# EAGLE design door (EAGLE 6.5.0)
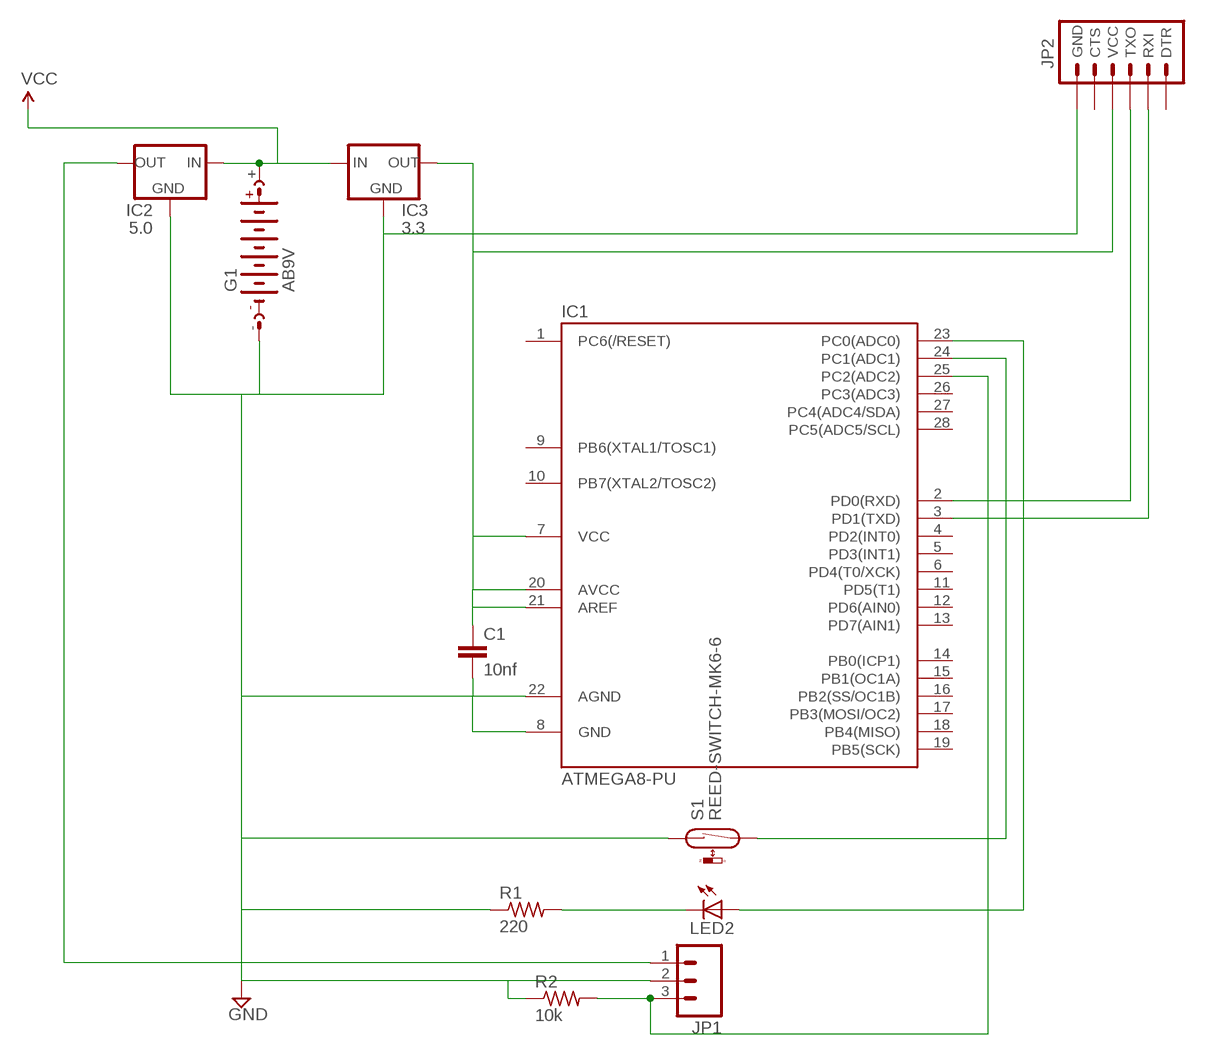
[diagram p0: schematic, sheet 1]

## Parts
C1  10nf  C2.5/4  [C2.5-4]
G1  AB9V  [AB9V]
IC1  ATMEGA8-PU  [DIL28-3]
IC2  5.0  V_REG_78XXSINK  [TO220-IGO]
IC3  3.3  V_REG_78XXSINK  [TO220-IGO]
JP1  M03PTH  [1X03]
JP2  ARDUINO_SERIAL_PROGRAMLONGPADS  [1X06_LONGPADS]
LED2  LED3MM  [LED3MM]
R1  220  R-US_0207/12  [0207/12]
R2  10k  R-US_0207/12  [0207/12]
S1  REED-SWITCH-MK6-6  [MK6-6]

## Nets
GND: C1.2 G1.- IC1.8(GND) IC1.22(AGND) IC2.GND IC3.GND JP1.2(GND) JP2.6(GND) R1.1 R2.1 S1.1
N$1: IC2.OUT JP1.1(OUT)
N$2: IC1.3(PD1(TXD)) JP2.2(RXI)
N$3: IC1.2(PD0(RXD)) JP2.3(TXO)
N$4: IC1.24(PC1(ADC1)) S1.2
N$5: IC1.23(PC0(ADC0)) LED2.A
N$6: IC1.25(PC2(ADC2)) JP1.3(VCC) R2.2
N$7: LED2.K(C) R1.2
N$8: C1.1 IC1.7(VCC) IC1.20(AVCC) IC1.21(AREF) IC3.OUT JP2.4(VCC)
VCC: G1.+ IC2.IN IC3.IN
Unconnected: IC1.1(PC6(/RESET)) IC1.4(PD2(INT0)) IC1.5(PD3(INT1)) IC1.6(PD4(T0/XCK)) IC1.9(PB6(XTAL1/TOSC1)) IC1.10(PB7(XTAL2/TOSC2)) IC1.11(PD5(T1)) IC1.12(PD6(AIN0)) IC1.13(PD7(AIN1)) IC1.14(PB0(ICP1)) IC1.15(PB1(OC1A)) IC1.16(PB2(SS/OC1B)) IC1.17(PB3(MOSI/OC2)) IC1.18(PB4(MISO)) IC1.19(PB5(SCK)) IC1.26(PC3(ADC3)) IC1.27(PC4(ADC4/SDA)) IC1.28(PC5(ADC5/SCL)) JP2.1(DTR) JP2.5(CTS)

## Library data of the parts
C1 = capacitor-wima:C: CAPACITOR naming: grid - package width
G1 = battery:AB9V: 9-V BATTERY CLIP
IC1 = atmega8:ATMEGA8-PU
IC2 IC3 = SparkFun:V_REG_78XX: Voltage Regulator Standard 7805 5V regulator. IGO (Input Ground Output). Spark Fun Electronics SKU : COM-00107
JP1 = SparkFun:M03: Header 3 Standard 3-pin 0.1" header. Use with straight break away headers (SKU : PRT-00116), right angle break away headers (PRT-00553), swiss pins (PRT-00743), machine pins (PRT-00117), and female headers (PRT-00115). Molex polarized connector foot print use with SKU : PRT-08232 with associated crimp pins and housings.
JP2 = SparkFun:ARDUINO_SERIAL_PROGRAM
LED2 = led:LED: LED OSRAM: - CHIPLED LG R971, LG N971, LY N971, LG Q971, LY Q971, LO R971, LY R971 LH N974, LH R974 LS Q976, LO Q976, LY Q976 LO Q996 - Hyper CHIPLED LW Q18S LB Q993, LB Q99A, LB R99A - SideLED LS A670, LO A670, LY A670, LG A670, LP A670 LB A673, LV A673, LT A673, LW A673 LH A674 LY A675 LS A676, LA A676, LO A676, LY A676, LW A676 LS A679, LY A679, LG A679 - Hyper Micro SIDELED® LS Y876, LA Y876, LO Y876, LY Y876 LT Y87S - SmartLED LW L88C, LW L88S LB L89C, LB L89S, LG L890 LS L89K, LO L89K, LY L89K LS L896, LA L896, LO L896, LY L896 - TOPLED LS T670, LO T670, LY T670, LG T670, LP T670 LSG T670, LSP T670, LSY T670, LOP T670, LYG T670 LG T671, LOG T671, LSG T671 LB T673, LV T673, LT T673, LW T673 LH T674 LS T676, LA T676, LO T676, LY T676, LB T676, LH T676, LSB T676, LW T676 LB T67C, LV T67C, LT T67C, LS T67K, LO T67K, LY T67K, LW E67C LS E67B, LA E67B, LO E67B, LY E67B, LB E67C, LV E67C, LT E67C LW T67C LS T679, LY T679, LG T679 LS T770, LO T770, LY T770, LG T770, LP T770 LB T773, LV T773, LT T773, LW T773 LH T774 LS E675, LA E675, LY E675, LS T675 LS T776, LA T776, LO T776, LY T776, LB T776 LHGB T686 LT T68C, LB T68C - Hyper Mini TOPLED® LB M676 - Mini TOPLED Santana® LG M470 LS M47K, LO M47K, LY M47K Source: http://www.osram.convergy.de LUXEON: - LUMILED® LXK2-PW12-R00, LXK2-PW12-S00, LXK2-PW14-U00, LXK2-PW14-V00 LXK2-PM12-R00, LXK2-PM12-S00, LXK2-PM14-U00 LXK2-PE12-Q00, LXK2-PE12-R00, LXK2-PE12-S00, LXK2-PE14-T00, LXK2-PE14-U00 LXK2-PB12-K00, LXK2-PB12-L00, LXK2-PB12-M00, LXK2-PB14-N00, LXK2-PB14-P00, LXK2-PB14-Q00 LXK2-PR12-L00, LXK2-PR12-M00, LXK2-PR14-Q00, LXK2-PR14-R00 LXK2-PD12-Q00, LXK2-PD12-R00, LXK2-PD12-S00 LXK2-PH12-R00, LXK2-PH12-S00 LXK2-PL12-P00, LXK2-PL12-Q00, LXK2-PL12-R00 Source: www.luxeon.com KINGBRIGHT: KA-3528ASYC Source: www.kingbright.com
R1 R2 = resistor:R-US_: RESISTOR, American symbol
S1 = switch-reed:REED-SWITCH-: Reed Sensor; OC_FARNELL: unknown

## Board
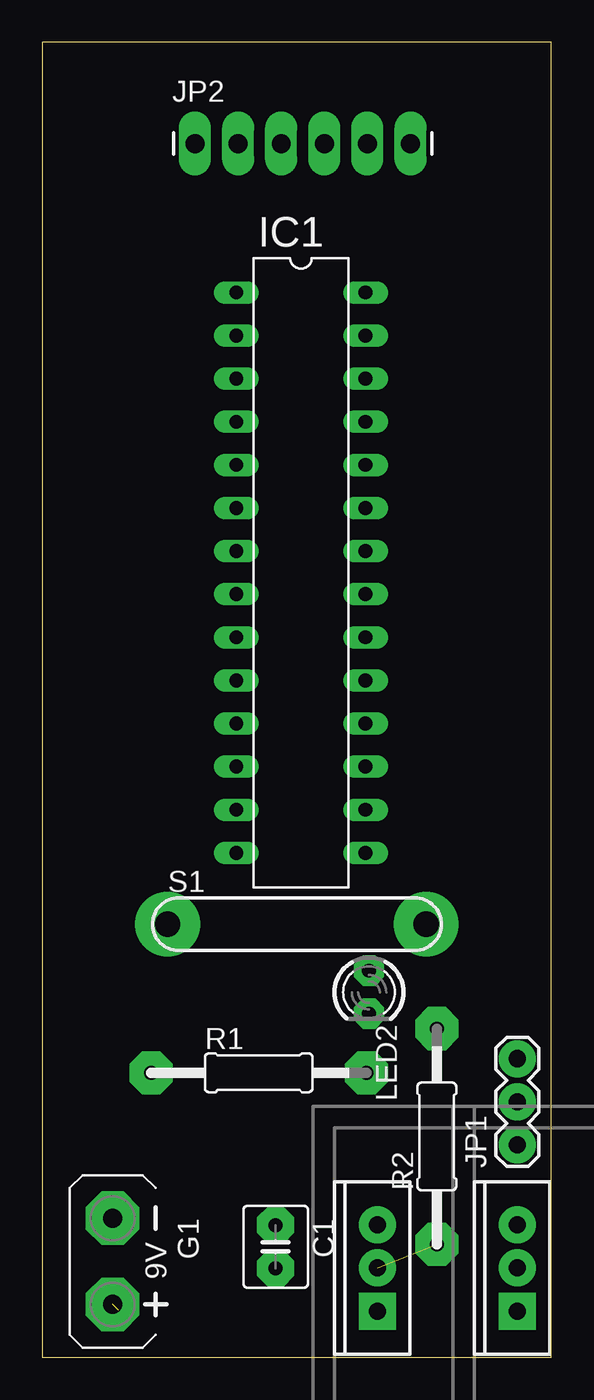
[diagram p1: board, top side]
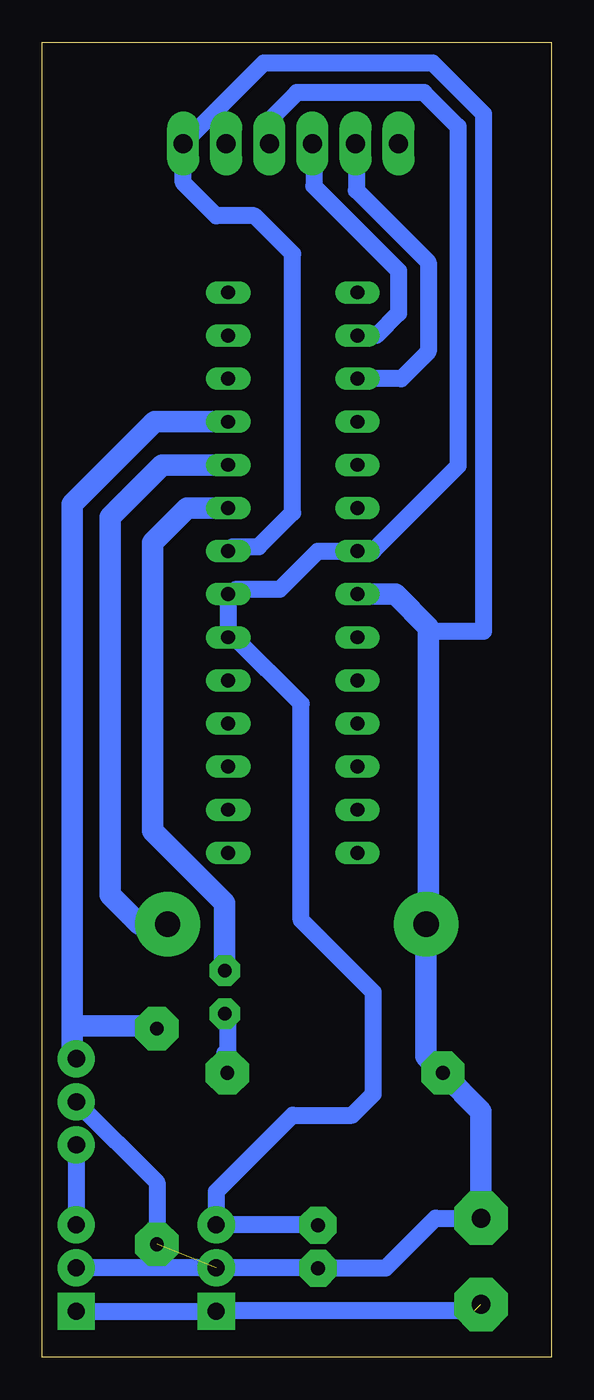
[diagram p2: board, bottom side, seen from below]

Size 30 x 77.46 mm. Coordinates in mm from the lower left corner, seen from the top.
Outline: 0,0 30,0 30,77.46 0,77.46 0,0
Copper layers (1*16): Top 0.035mm / dielectric 1.5mm / Bottom 0.035mm
Design rules "default *": minimum track width 10mil, minimum drill 24mil, track to track 8mil, track to pad 8mil, pad to pad 8mil, via to via 8mil, smd to smd 8mil, copper to edge 40mil, drill to drill 8mil, minimum pad ring 10mil, minimum via ring 8mil, stop-mask expansion 6mil, vias tented up to drill 0mil, thermal gap 10mil

### Footprints (pad centres in the part's own frame; a part is rotated, then mirrored left to right if it is on the bottom)
C2.5-4 = drill 0.813 pad 2.184 octagon: 1 -1.27,0; 2 1.27,0
AB9V = drill 1.118 pad 3.15 octagon: + 0,2.54; - 0,-2.54
DIL28-3 = drill 0.813 long: 1 -16.51,-3.81; 2 -13.97,-3.81; 3 -11.43,-3.81; 4 -8.89,-3.81; 5 -6.35,-3.81; 6 -3.81,-3.81; 7 -1.27,-3.81; 8 1.27,-3.81; 9 3.81,-3.81; 10 6.35,-3.81; 11 8.89,-3.81; 12 11.43,-3.81; 13 13.97,-3.81; 14 16.51,-3.81; 15 16.51,3.81; 16 13.97,3.81; 17 11.43,3.81; 18 8.89,3.81; 19 6.35,3.81; 20 3.81,3.81; 21 1.27,3.81; 22 -1.27,3.81; 23 -3.81,3.81; 24 -6.35,3.81; 25 -8.89,3.81; 26 -11.43,3.81; 27 -13.97,3.81; 28 -16.51,3.81
TO220-IGO = drill 1 pad 2.184: GND 0,0; OUT 2.54,0 | drill 1 pad 2.184 square: IN -2.54,0
1X03 = drill 1.016 pad 2.184: 1 0,0; 2 2.54,0; 3 5.08,0
1X06_LONGPADS = drill 1.118 pad 1.88 long: 1 0,0; 2 2.54,0; 3 5.08,0; 4 7.62,0; 5 10.16,0; 6 12.7,0
LED3MM = drill 0.813 pad 1.778 octagon: A -1.27,0; K 1.27,0
0207/12 = drill 0.813 pad 2.54 octagon: 1 -6.35,0; 2 6.35,0
MK6-6 = drill 1.5 pad 3.81: 1 -7.62,0; 2 7.62,0

### Placement (x,y rotation side)
C1  13.75,6.5 270 top
G1  4.14,5.64 180 top
IC1  15.24,46.22 270 top
IC2  28,5.25 90 top
IC3  19.75,5.25 90 top
JP1  28,12.5 90 top
JP2  9,71.5 0 top
LED2  19.25,21.5 270 top
R1  12.75,16.75 0 top
R2  23.25,13 90 top
S1  15,25.5 0 top

### Tracks (layer width: path | path; a pad name or v marks a point on that pad's centre or on a via)
GND  (1 unrouted)
  Bottom 1.016: 7.25,42.75 4,42.75 4,73.25 7,76.25 16.95,76.25 JP2.6 21.7,69.2 19.75,67.25 17.5,67.25 15.25,65 15.25,49.75 17.25,47.75 18.79,47.75 IC1.22 | JP1.2 23.25,10.29 R2.1 | IC2.GND IC3.GND 13.77,5.25 C1.2 13.73,5.25 9.75,5.25 6.82,8.18 G1.-
  Bottom 1.27: G1.- 4.14,14.49 R1.1 7.38,17.73 S1.1 7.25,25.63 7.25,42.75 7.25,43 9.2,44.95 IC1.8
N$1
  Bottom 1.016: JP1.1 IC2.OUT
N$2
  Bottom 1.016: JP2.2 11.5,71.46 11.5,68.75 7.25,64.5 7.25,59.25 8.85,57.65 IC1.3
N$3
  Bottom 1.016: JP2.3 14,71.42 14,69 9,64 9,61.5 10.31,60.19 IC1.2
N$4
  Bottom 1.27: IC1.24 22.93,52.57 26,49.5 26,27.23 24.27,25.5 S1.2
N$5
  Bottom 1.27: LED2.A 19.25,26.75 23.5,31 23.5,48 21.47,50.03 IC1.23
N$6
  Bottom 1.016: R2.2 23.4,19.5
  Bottom 1.27: 28.25,19.5 28.25,50.25 23.39,55.11 IC1.25 | 23.4,19.5 28.25,19.5 | JP1.3 28.25,17.58 28.25,19.5
N$7
  Bottom 1.016: 19.25,17.9 R1.2 19.1,20.08 LED2.K
N$8
  Bottom 1.016: JP2.4 16.62,72.88 15,74.5 7.5,74.5 5.5,72.5 5.5,52.5 10.51,47.49 IC1.7 13.76,47.49 16,45.25 18.56,45.25 18.95,44.85 19.05,44.76 IC1.20 18.66,42.41 14.75,38.5 14.75,25.75 10.5,21.5 10.5,15.5 11.75,14.25 15.25,14.25 19.75,9.75 IC3.OUT 13.77,7.79 C1.1
  Bottom 1.27: IC1.21 18.95,44.85
VCC  (1 unrouted)
  Bottom 1.016: IC2.IN IC3.IN 19.71,2.75 4.5,2.75
  Bottom 1.27: G1.+ 4.18,3.81